# EAGLE schematic attiny_base (EAGLE 6.4)
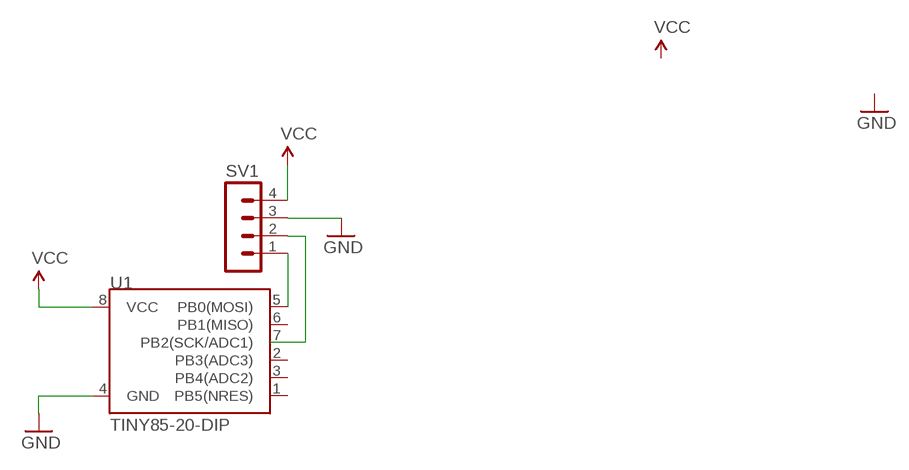
[diagram p0: schematic, sheet 1]

## Parts
SV1  MA04-1  [MA04-1]
U1  TINY85-20-DIP  ATTINY45TINY85-20-DIP  [DIP08]

## Nets
GND: SV1.3 U1.4(GND)
N$1: SV1.1 U1.5(PB0(MOSI))
N$2: SV1.2 U1.7(PB2(SCK/ADC1))
VCC: SV1.4 U1.8(VCC)
Unconnected: U1.1(PB5(NRES)) U1.2(PB3(ADC3)) U1.3(PB4(ADC2)) U1.6(PB1(MISO))

## Library data of the parts
SV1 = con-lstb:MA04-1: PIN HEADER; OC_FARNELL: unknown; OC_NEWARK: unknown
U1 = SparkFun-DigitalIC:ATTINY45: Atmel 8-pin 2/4/8kB flash uC; PROD_ID: IC-09445